# Altium schematic sheet ADC_1_MUL.SchDoc
size 420 x 297 mm; SheetNumber: 5; SheetTotal: 13
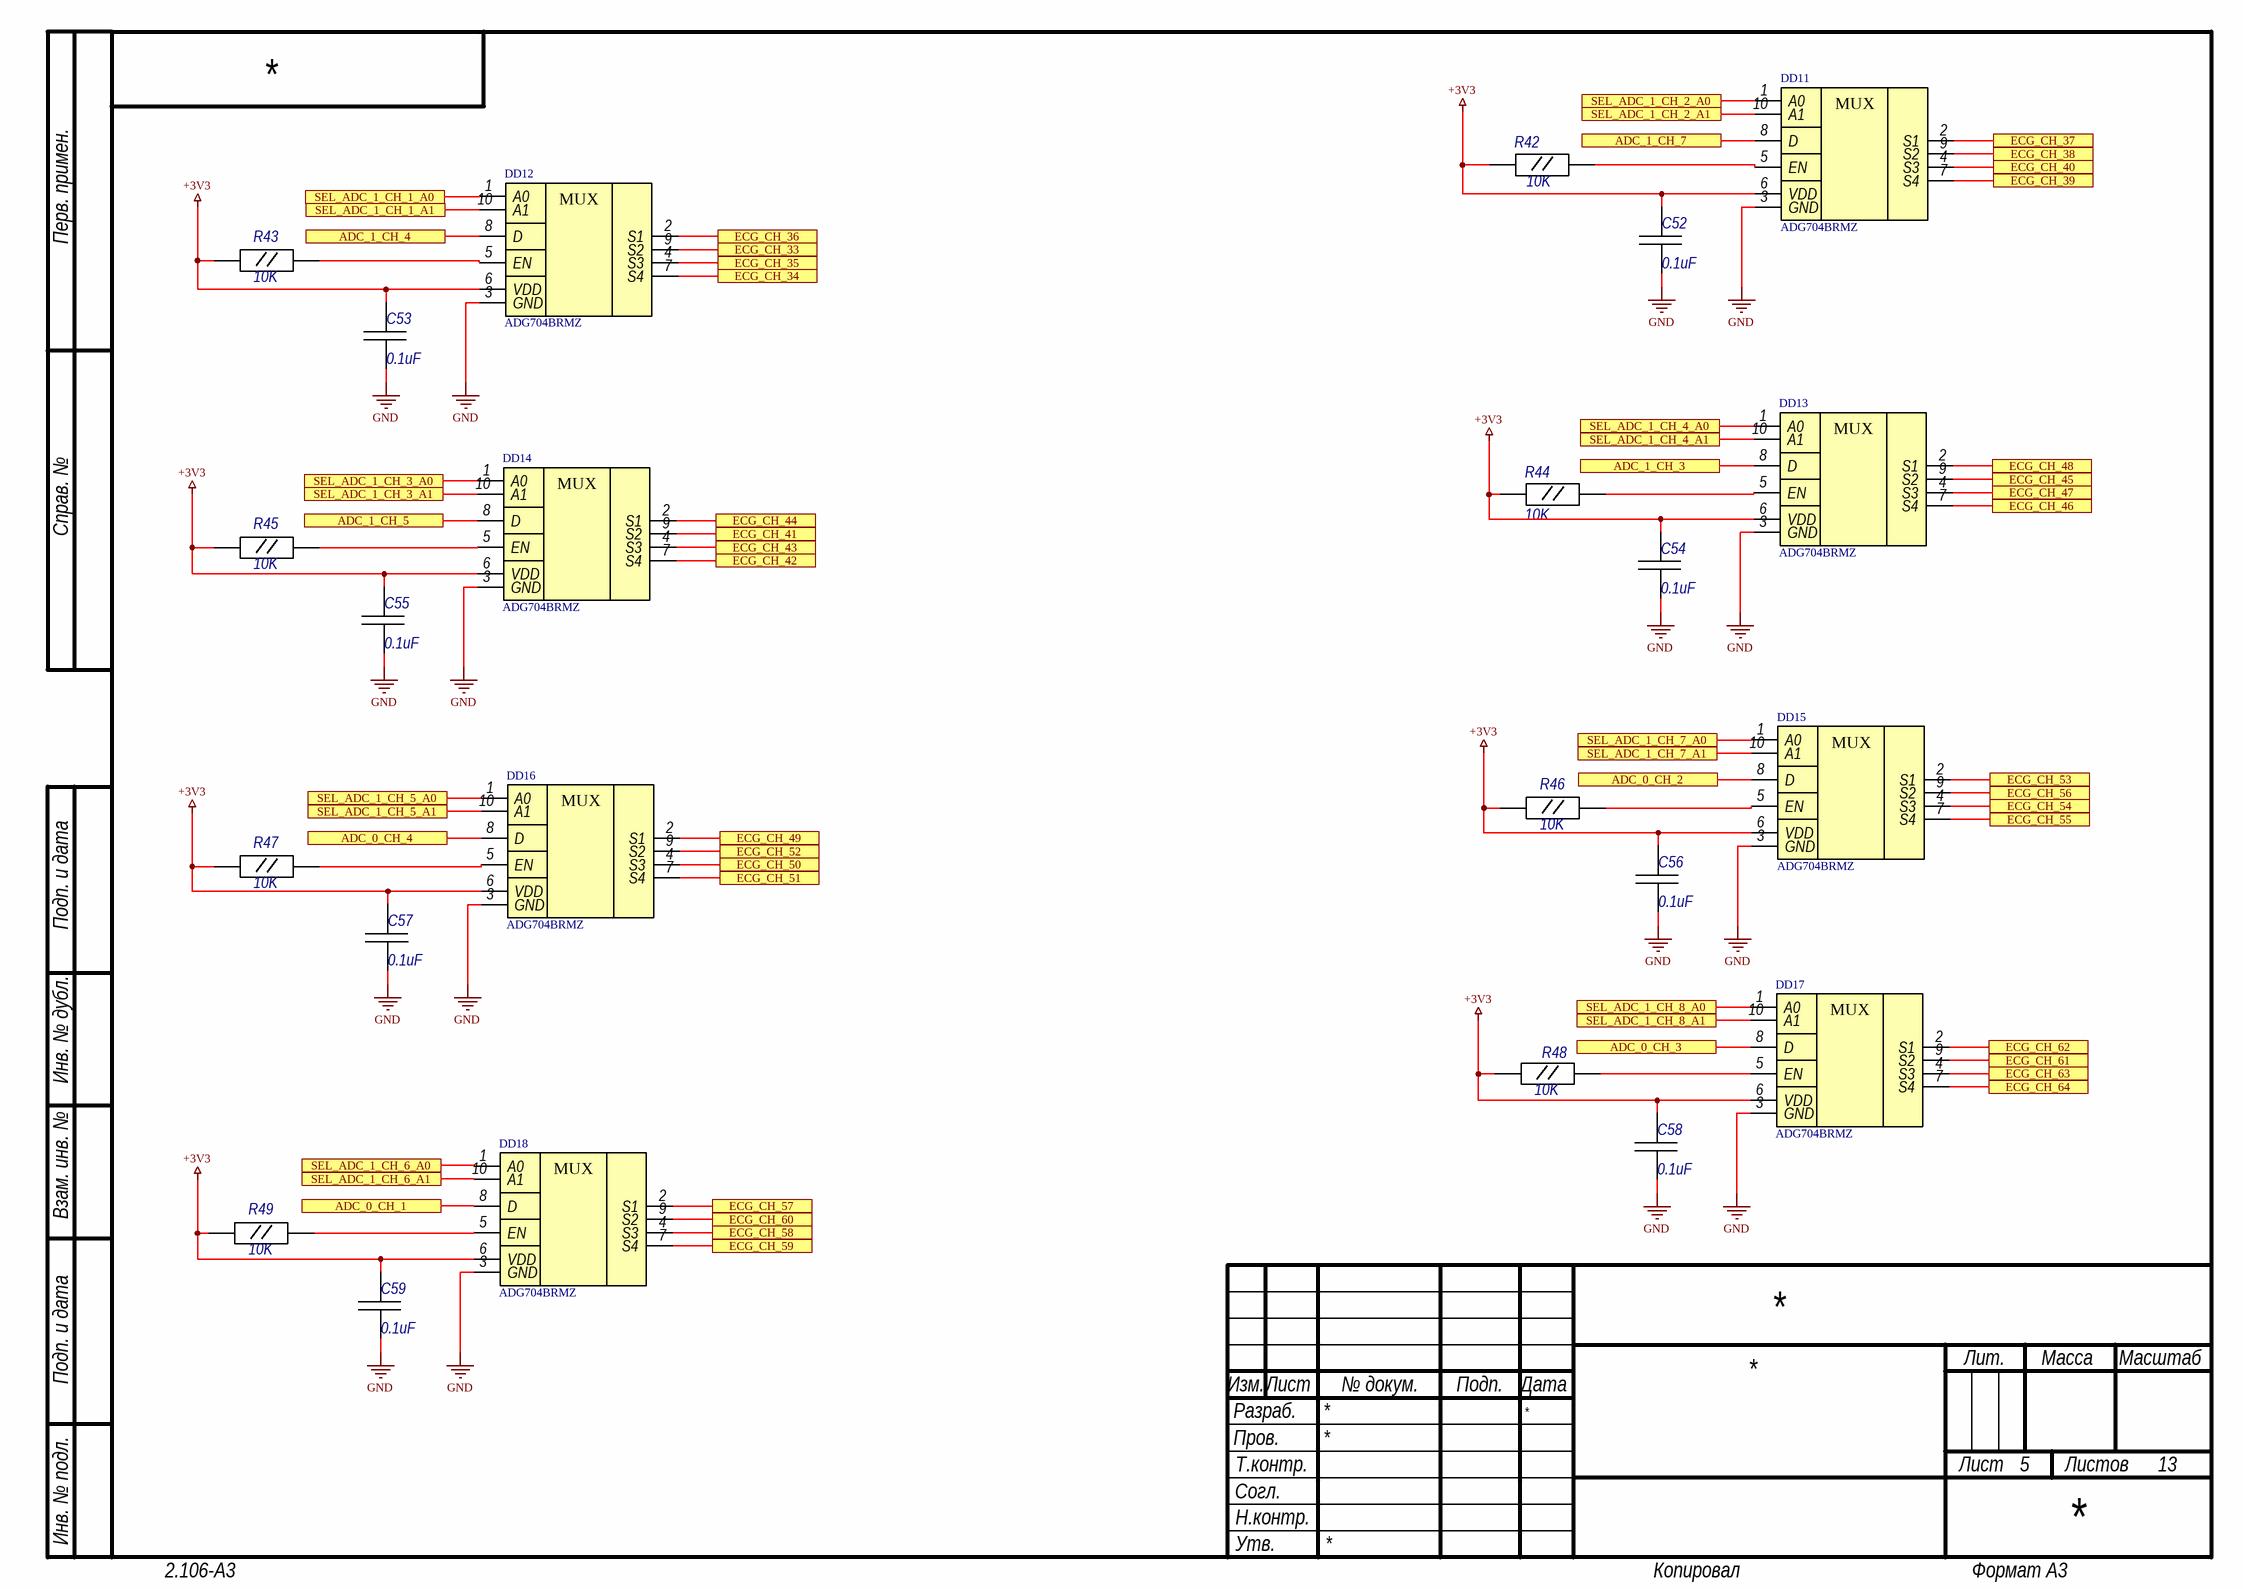
[diagram p0: ADC_1_MUL.SchDoc]

## Parts
C52  0.1uF  [C0603]
C53  0.1uF  [C0603]
C54  0.1uF  [C0603]
C55  0.1uF  [C0603]
C56  0.1uF  [C0603]
C57  0.1uF  [C0603]
C58  0.1uF  [C0603]
C59  0.1uF  [C0603]
DD11  ADG704BRMZ  [MSOP-10]
DD12  ADG704BRMZ  [MSOP-10]
DD13  ADG704BRMZ  [MSOP-10]
DD14  ADG704BRMZ  [MSOP-10]
DD15  ADG704BRMZ  [MSOP-10]
DD16  ADG704BRMZ  [MSOP-10]
DD17  ADG704BRMZ  [MSOP-10]
DD18  ADG704BRMZ  [MSOP-10]
R42  10K  [R0603]
R43  10K  [R0603]
R44  10K  [R0603]
R45  10K  [R0603]
R46  10K  [R0603]
R47  10K  [R0603]
R48  10K  [R0603]
R49  10K  [R0603]

## Ports
ADC_0_CH_1, ADC_0_CH_2, ADC_0_CH_3, ADC_0_CH_4, ADC_1_CH_3, ADC_1_CH_4, ADC_1_CH_5, ADC_1_CH_7, ECG_CH_33, ECG_CH_34, ECG_CH_35, ECG_CH_36, ECG_CH_37, ECG_CH_38, ECG_CH_39, ECG_CH_40, ECG_CH_41, ECG_CH_42, ECG_CH_43, ECG_CH_44, ECG_CH_45, ECG_CH_46, ECG_CH_47, ECG_CH_48, ECG_CH_49, ECG_CH_50, ECG_CH_51, ECG_CH_52, ECG_CH_53, ECG_CH_54, ECG_CH_55, ECG_CH_56, ECG_CH_57, ECG_CH_58, ECG_CH_59, ECG_CH_60, ECG_CH_61, ECG_CH_62, ECG_CH_63, ECG_CH_64, SEL_ADC_1_CH_1_A0, SEL_ADC_1_CH_1_A1, SEL_ADC_1_CH_2_A0, SEL_ADC_1_CH_2_A1, SEL_ADC_1_CH_3_A0, SEL_ADC_1_CH_3_A1, SEL_ADC_1_CH_4_A0, SEL_ADC_1_CH_4_A1, SEL_ADC_1_CH_5_A0, SEL_ADC_1_CH_5_A1, SEL_ADC_1_CH_6_A0, SEL_ADC_1_CH_6_A1, SEL_ADC_1_CH_7_A0, SEL_ADC_1_CH_7_A1, SEL_ADC_1_CH_8_A0, SEL_ADC_1_CH_8_A1

## Nets
+3V3: C52.2 C53.2 C54.2 C55.2 C56.2 C57.2 C58.2 C59.2 DD11.6(VDD) DD12.6(VDD) DD13.6(VDD) DD14.6(VDD) DD15.6(VDD) DD16.6(VDD) DD17.6(VDD) DD18.6(VDD) R42.1 R43.1 R44.1 R45.1 R46.1 R47.1 R48.1 R49.1
GND: C52.1 C53.1 C54.1 C55.1 C56.1 C57.1 C58.1 C59.1 DD11.3(GND) DD12.3(GND) DD13.3(GND) DD14.3(GND) DD15.3(GND) DD16.3(GND) DD17.3(GND) DD18.3(GND)
ADC_0_CH_1: DD18.8(D) ; port ADC_0_CH_1
ADC_0_CH_2: DD15.8(D) ; port ADC_0_CH_2
ADC_0_CH_3: DD17.8(D) ; port ADC_0_CH_3
ADC_0_CH_4: DD16.8(D) ; port ADC_0_CH_4
ADC_1_CH_3: DD13.8(D) ; port ADC_1_CH_3
ADC_1_CH_4: DD12.8(D) ; port ADC_1_CH_4
ADC_1_CH_5: DD14.8(D) ; port ADC_1_CH_5
ADC_1_CH_7: DD11.8(D) ; port ADC_1_CH_7
ECG_CH_33: DD12.9(S2) ; port ECG_CH_33
ECG_CH_34: DD12.7(S4) ; port ECG_CH_34
ECG_CH_35: DD12.4(S3) ; port ECG_CH_35
ECG_CH_36: DD12.2(S1) ; port ECG_CH_36
ECG_CH_37: DD11.2(S1) ; port ECG_CH_37
ECG_CH_38: DD11.9(S2) ; port ECG_CH_38
ECG_CH_39: DD11.7(S4) ; port ECG_CH_39
ECG_CH_40: DD11.4(S3) ; port ECG_CH_40
ECG_CH_41: DD14.9(S2) ; port ECG_CH_41
ECG_CH_42: DD14.7(S4) ; port ECG_CH_42
ECG_CH_43: DD14.4(S3) ; port ECG_CH_43
ECG_CH_44: DD14.2(S1) ; port ECG_CH_44
ECG_CH_45: DD13.9(S2) ; port ECG_CH_45
ECG_CH_46: DD13.7(S4) ; port ECG_CH_46
ECG_CH_47: DD13.4(S3) ; port ECG_CH_47
ECG_CH_48: DD13.2(S1) ; port ECG_CH_48
ECG_CH_49: DD16.2(S1) ; port ECG_CH_49
ECG_CH_50: DD16.4(S3) ; port ECG_CH_50
ECG_CH_51: DD16.7(S4) ; port ECG_CH_51
ECG_CH_52: DD16.9(S2) ; port ECG_CH_52
ECG_CH_53: DD15.2(S1) ; port ECG_CH_53
ECG_CH_54: DD15.4(S3) ; port ECG_CH_54
ECG_CH_55: DD15.7(S4) ; port ECG_CH_55
ECG_CH_56: DD15.9(S2) ; port ECG_CH_56
ECG_CH_57: DD18.2(S1) ; port ECG_CH_57
ECG_CH_58: DD18.4(S3) ; port ECG_CH_58
ECG_CH_59: DD18.7(S4) ; port ECG_CH_59
ECG_CH_60: DD18.9(S2) ; port ECG_CH_60
ECG_CH_61: DD17.9(S2) ; port ECG_CH_61
ECG_CH_62: DD17.2(S1) ; port ECG_CH_62
ECG_CH_63: DD17.4(S3) ; port ECG_CH_63
ECG_CH_64: DD17.7(S4) ; port ECG_CH_64
SEL_ADC_1_CH_1_A0: DD12.1(A0) ; port SEL_ADC_1_CH_1_A0
SEL_ADC_1_CH_1_A1: DD12.10(A1) ; port SEL_ADC_1_CH_1_A1
SEL_ADC_1_CH_2_A0: DD11.1(A0) ; port SEL_ADC_1_CH_2_A0
SEL_ADC_1_CH_2_A1: DD11.10(A1) ; port SEL_ADC_1_CH_2_A1
SEL_ADC_1_CH_3_A0: DD14.1(A0) ; port SEL_ADC_1_CH_3_A0
SEL_ADC_1_CH_3_A1: DD14.10(A1) ; port SEL_ADC_1_CH_3_A1
SEL_ADC_1_CH_4_A0: DD13.1(A0) ; port SEL_ADC_1_CH_4_A0
SEL_ADC_1_CH_4_A1: DD13.10(A1) ; port SEL_ADC_1_CH_4_A1
SEL_ADC_1_CH_5_A0: DD16.1(A0) ; port SEL_ADC_1_CH_5_A0
SEL_ADC_1_CH_5_A1: DD16.10(A1) ; port SEL_ADC_1_CH_5_A1
SEL_ADC_1_CH_6_A0: DD18.1(A0) ; port SEL_ADC_1_CH_6_A0
SEL_ADC_1_CH_6_A1: DD18.10(A1) ; port SEL_ADC_1_CH_6_A1
SEL_ADC_1_CH_7_A0: DD15.1(A0) ; port SEL_ADC_1_CH_7_A0
SEL_ADC_1_CH_7_A1: DD15.10(A1) ; port SEL_ADC_1_CH_7_A1
SEL_ADC_1_CH_8_A0: DD17.1(A0) ; port SEL_ADC_1_CH_8_A0
SEL_ADC_1_CH_8_A1: DD17.10(A1) ; port SEL_ADC_1_CH_8_A1
NetDD11_5: DD11.5(EN) R42.2
NetDD12_5: DD12.5(EN) R43.2
NetDD13_5: DD13.5(EN) R44.2
NetDD14_5: DD14.5(EN) R45.2
NetDD15_5: DD15.5(EN) R46.2
NetDD16_5: DD16.5(EN) R47.2
NetDD17_5: DD17.5(EN) R48.2
NetDD18_5: DD18.5(EN) R49.2

## Notes on the sheet
- Перв. примен.
- Справ. №
- Подп. и дата
- Инв. № дубл.
- Взам. инв. №
- Разраб.
- Изм.
- Лист
- № докум.
- Подп.
- Дата
- Лит.
- Масса
- Масштаб
- Пров.
- Т.контр.
- Листов
- Инв. № подл.
- Согл.
- Утв.
- Н.контр.
- 2.106-A3
- Копировал
- Формат А3
- (in symbol MUX_ADG704BRMZ) MUX

## Library data of the parts
C52-C59 = CC_SMD_0603: Ceramic Capacitor SMD; Package: 0603; Value: 0.1uF
DD11-DD18 = MUX_ADG704BRMZ: 4-Channel Multiplexer; PartNumber: ADG704BRMZ; Package: MSOP-10
R42-R49 = R0603: Resistor SMD; Value: 10K